# EAGLE design Task2 (EAGLE 9.5.1)
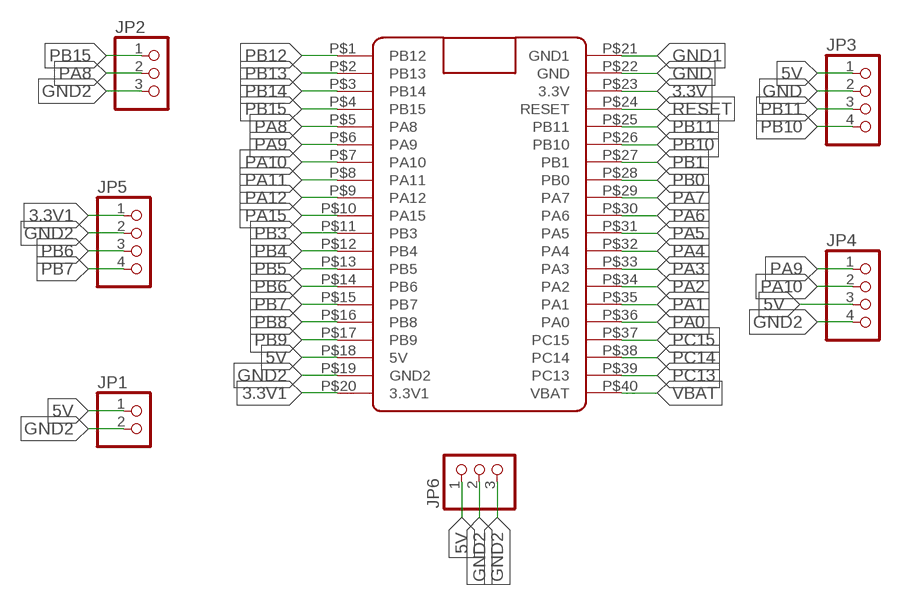
[diagram p0: schematic, sheet 1]

## Parts
JP1  PINHD-1X2  [1X02]
JP2  PINHD-1X3  [1X03]
JP3  PINHD-1X4  [1X04]
JP4  PINHD-1X4  [1X04]
JP5  PINHD-1X4  [1X04]
JP6  PINHD-1X3  [1X03]
U$1  BLUE_PILL  [BLUE_PILL]

## Nets
3.3V: U$1.P$23(3.3V)
3.3V1: JP5.1 U$1.P$20(3.3V1)
5V: JP1.1 JP3.1 JP4.3 JP6.1 U$1.P$18(5V)
GND: JP3.2 U$1.P$22(GND)
GND1: U$1.P$21(GND1)
GND2: JP1.2 JP2.3 JP4.4 JP5.2 JP6.2 JP6.3 U$1.P$19(GND2)
PA0: U$1.P$36(PA0)
PA1: U$1.P$35(PA1)
PA2: U$1.P$34(PA2)
PA3: U$1.P$33(PA3)
PA4: U$1.P$32(PA4)
PA5: U$1.P$31(PA5)
PA6: U$1.P$30(PA6)
PA7: U$1.P$29(PA7)
PA8: JP2.2 U$1.P$5(PA8)
PA9: JP4.1 U$1.P$6(PA9)
PA10: JP4.2 U$1.P$7(PA10)
PA11: U$1.P$8(PA11)
PA12: U$1.P$9(PA12)
PA15: U$1.P$10(PA15)
PB0: U$1.P$28(PB0)
PB1: U$1.P$27(PB1)
PB3: U$1.P$11(PB3)
PB4: U$1.P$12(PB4)
PB5: U$1.P$13(PB5)
PB6: JP5.3 U$1.P$14(PB6)
PB7: JP5.4 U$1.P$15(PB7)
PB8: U$1.P$16(PB8)
PB9: U$1.P$17(PB9)
PB10: JP3.4 U$1.P$26(PB10)
PB11: JP3.3 U$1.P$25(PB11)
PB12: U$1.P$1(PB12)
PB13: U$1.P$2(PB13)
PB14: U$1.P$3(PB14)
PB15: JP2.1 U$1.P$4(PB15)
PC13: U$1.P$39(PC13)
PC14: U$1.P$38(PC14)
PC15: U$1.P$37(PC15)
RESET: U$1.P$24(RESET)
VBAT: U$1.P$40(VBAT)

## Library data of the parts
JP1 = MIA-Training:PINHD-1X2: PIN HEADER
JP2 JP6 = MIA-Training:PINHD-1X3: PIN HEADER
JP3-JP5 = MIA-Training:PINHD-1X4: PIN HEADER
U$1 = BluePill:BLUE_PILL

## Board
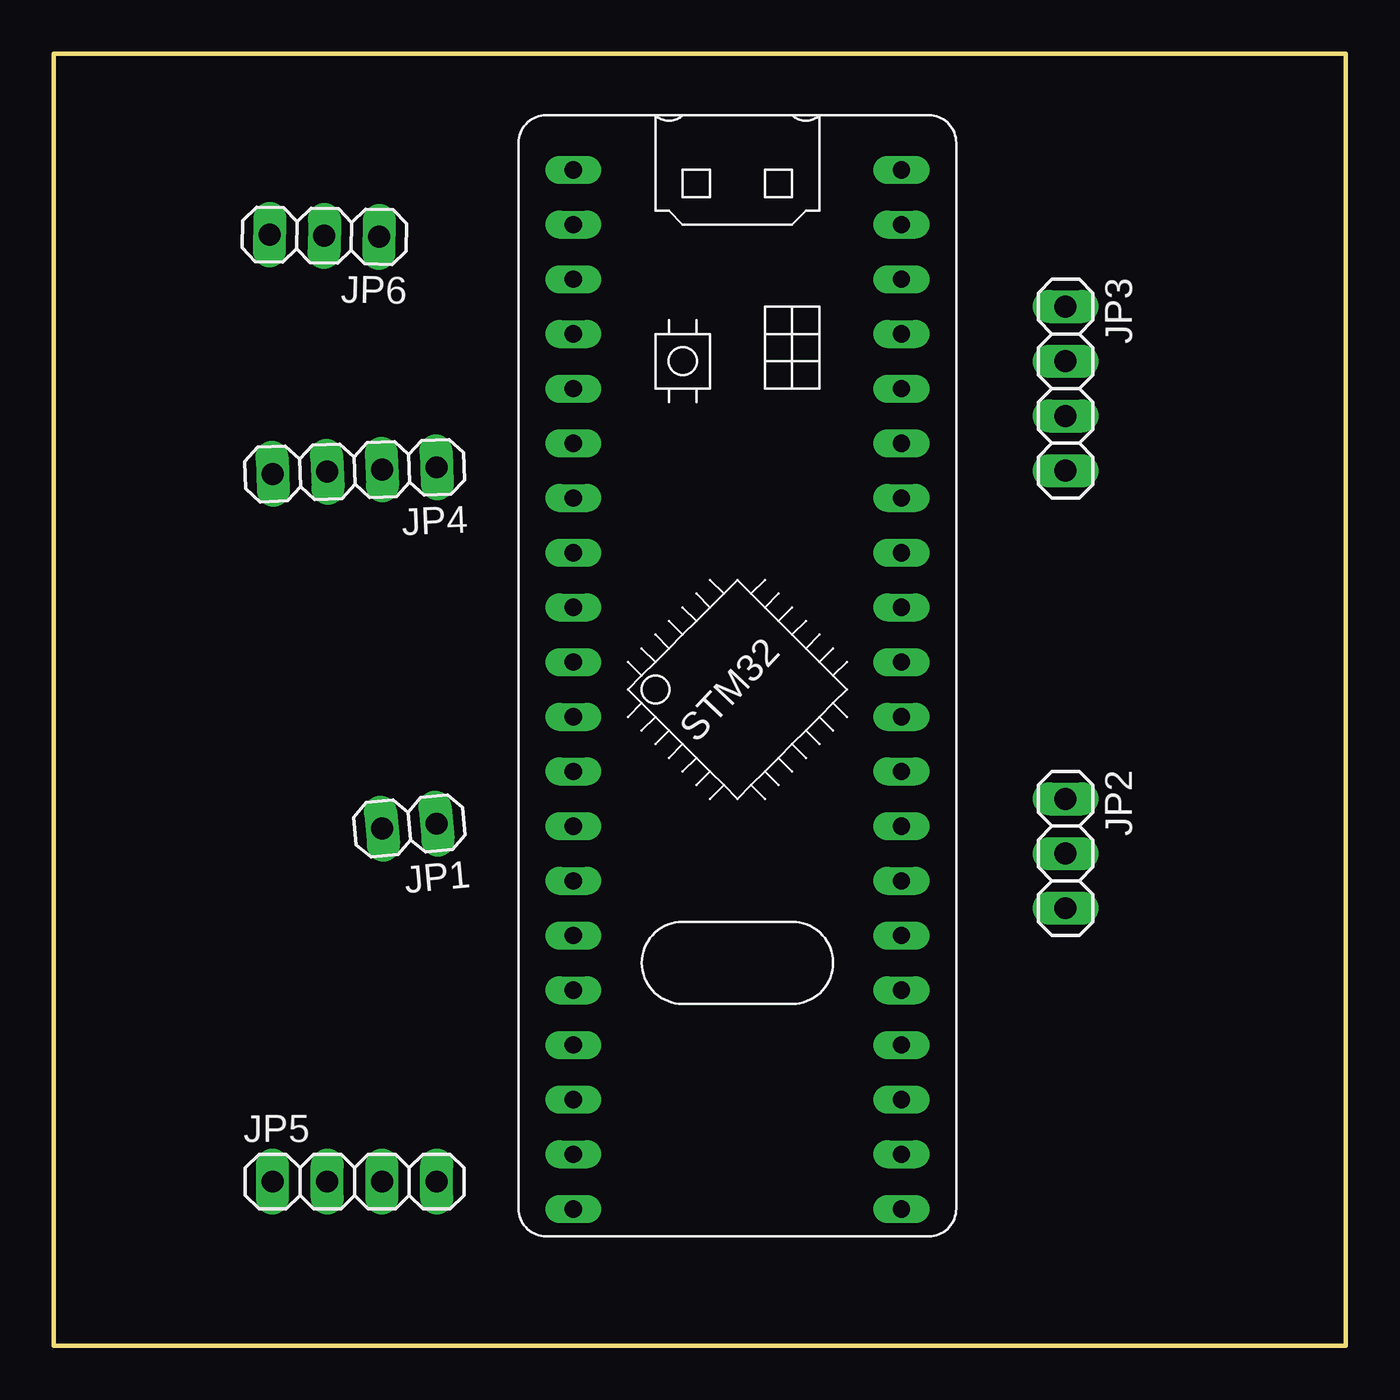
[diagram p1: board, top side]
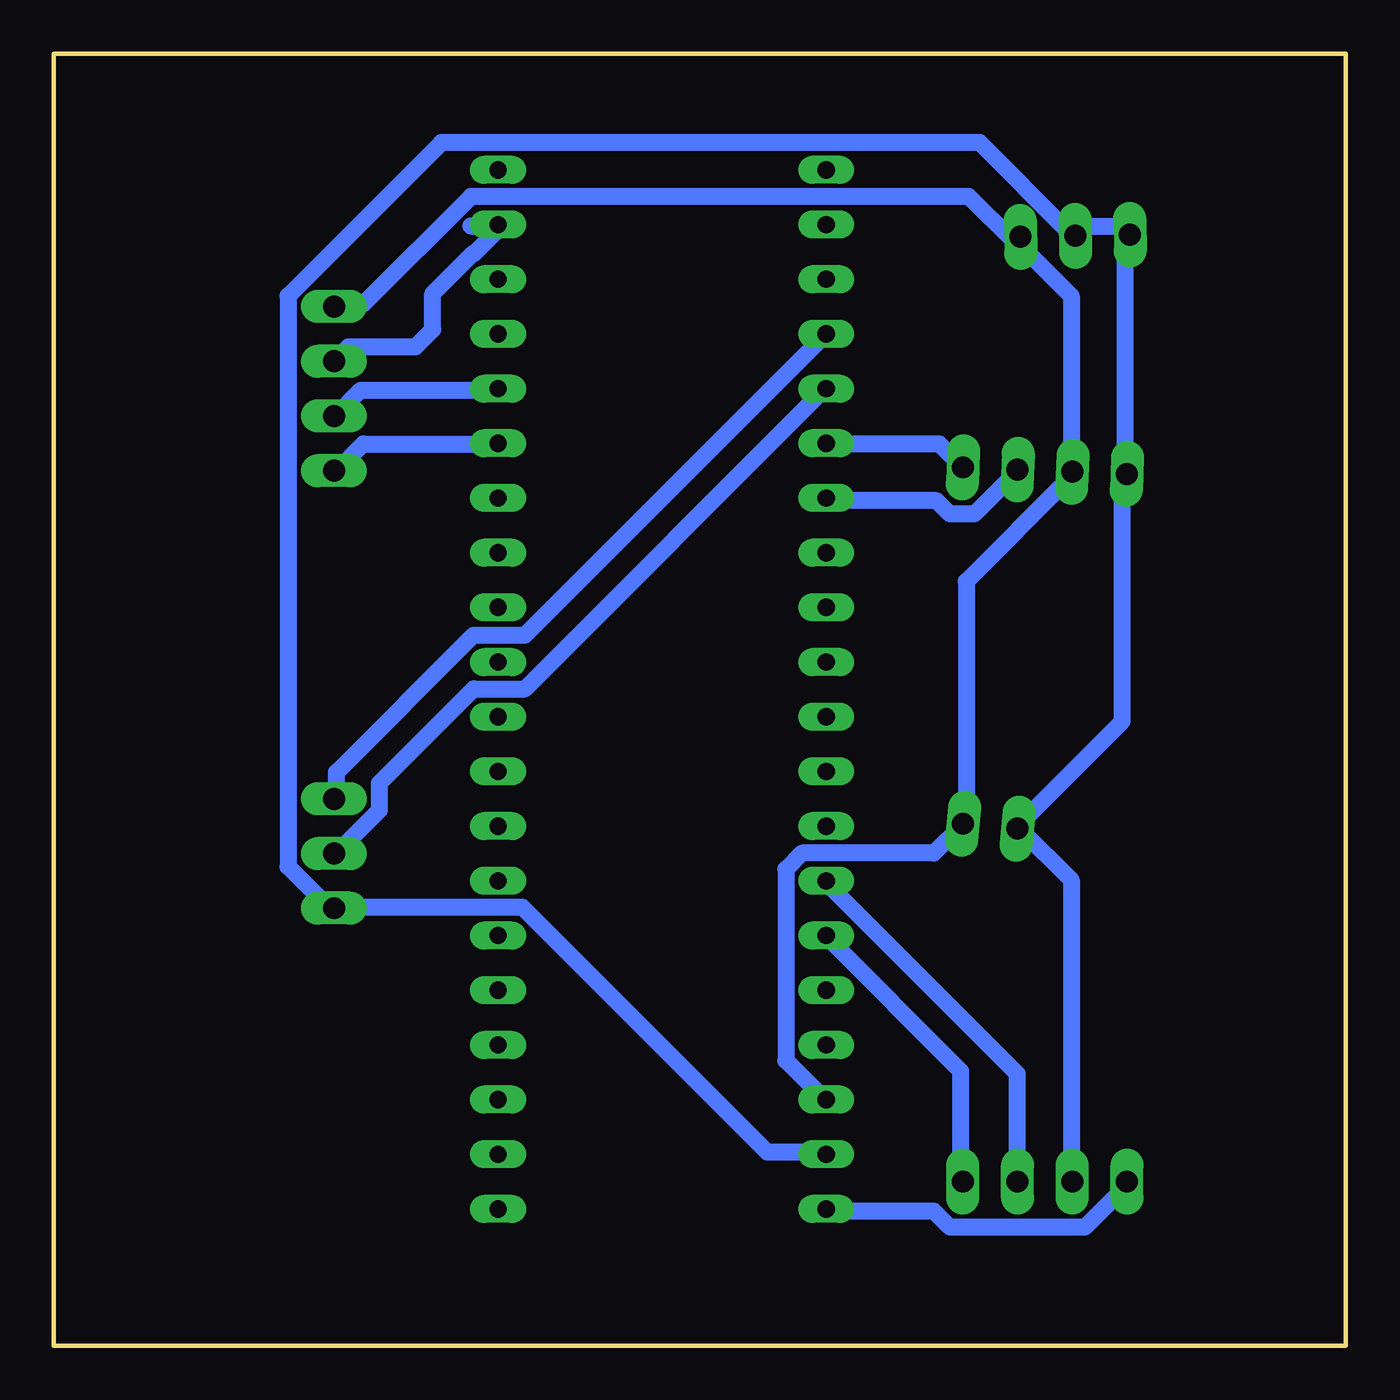
[diagram p2: board, bottom side, seen from below]

Size 60 x 60 mm. Coordinates in mm from the lower left corner, seen from the top.
Outline: 0,0 0,60 60,60 60,0 0,0
Copper layers (1*16): Top 0.035mm / dielectric 1.5mm / Bottom 0.035mm
Design rules "default *": minimum track width 0.8mm, minimum drill 0.35mm, track to track 6mil, track to pad 6mil, pad to pad 6mil, via to via 6mil, smd to smd 6mil, copper to edge 40mil, drill to drill 6mil, minimum pad ring 10mil, minimum via ring 8mil, stop-mask expansion 4mil, vias tented up to drill 0mil, thermal gap 10mil

### Footprints (pad centres in the part's own frame; a part is rotated, then mirrored left to right if it is on the bottom)
1X02 = drill 1.016 long: 1 -1.27,0; 2 1.27,0
1X03 = drill 1.016 long: 1 -2.54,0; 2 0,0; 3 2.54,0
1X04 = drill 1.016 long: 1 -3.81,0; 2 -1.27,0; 3 1.27,0; 4 3.81,0
BLUE_PILL = drill 0.8 long: P$1 -7.62,15.24; P$2 -7.62,12.7; P$3 -7.62,10.16; P$4 -7.62,7.62; P$5 -7.62,5.08; P$6 -7.62,2.54; P$7 -7.62,0; P$8 -7.62,-2.54; P$9 -7.62,-5.08; P$10 -7.62,-7.62; P$11 -7.62,-10.16; P$12 -7.62,-12.7; P$13 -7.62,-15.24; P$14 -7.62,-17.78; P$15 -7.62,-20.32; P$16 -7.62,-22.86; P$17 -7.62,-25.4; P$18 -7.62,-27.94; P$19 -7.62,-30.48; P$20 -7.62,-33.02; P$21 7.62,15.24; P$22 7.62,12.7; P$23 7.62,10.16; P$24 7.62,7.62; P$25 7.62,5.08; P$26 7.62,2.54; P$27 7.62,0; P$28 7.62,-2.54; P$29 7.62,-5.08; P$30 7.62,-7.62; P$31 7.62,-10.16; P$32 7.62,-12.7; P$33 7.62,-15.24; P$34 7.62,-17.78; P$35 7.62,-20.32; P$36 7.62,-22.86; P$37 7.62,-25.4; P$38 7.62,-27.94; P$39 7.62,-30.48; P$40 7.62,-33.02

### Placement (x,y rotation side)
JP1  16.51,24.13 185.2 top
JP2  46.99,22.86 270 top
JP3  46.99,44.45 270 top
JP4  13.97,40.64 182.3 top
JP5  13.97,7.62 0 top
JP6  12.56,51.55 178.9 top
U$1  31.75,39.37 0 top

### Tracks (layer width: path | path; a pad name or v marks a point on that pad's centre or on a via)
3.3V1
  Bottom 0.8: U$1.P$20 24.12,6.25 19.12,6.25 18.38,5.5 12.12,5.5 10.12,7.5 JP5.1
5V
  Bottom 0.8: U$1.P$18 24.25,11.5 26,13.25 26,22.12 25.25,22.88 19.12,22.88 17.88,24.12 JP1.1 17.62,24.62 17.62,35.5 12.88,40.25 JP4.3 12.75,40.62 12.75,48.75 15,51 JP6.1 15.38,51.25 17.5,53.38 40.62,53.38 45.62,48.38 46.88,48.38 JP3.1
GND
  Bottom 0.8: 40.62,52 39.38,52 | 39.38,52 U$1.P$22 | 46.88,45.75 JP3.2 46.31,46.4 43.2,46.4 42.4,47.2 42.4,48.86 40.52,50.74 40.46,50.74 39.38,51.83 39.38,52
GND2
  Bottom 0.8: U$1.P$19 24.25,9 26.88,9 38.25,20.38 46.88,20.38 JP2.3 47.25,20.62 47.5,20.62 49.12,22.25 49.12,48.75 42,55.88 17,55.88 12.88,51.75 JP6.2 12.5,51.62 12.12,52 10.12,52 JP6.3 10.25,51.62 10.25,40.5 JP4.4 10.38,40.12 10.38,29 15,24.38 JP1.2 15.12,24 12.75,21.62 12.75,7.62 JP5.2
PA8
  Bottom 0.8: U$1.P$5 24.25,44.38 38.12,30.5 40.5,30.5 44.88,26.12 44.88,24.88 46.88,22.88 JP2.2
PA9
  Bottom 0.8: U$1.P$6 24.12,41.88 18.88,41.88 17.88,40.88 JP4.1
PA10
  Bottom 0.8: U$1.P$7 24.12,39.25 19,39.25 18.38,38.62 17.25,38.62 15.25,40.62 JP4.2
PB6
  Bottom 0.8: U$1.P$14 24.12,21.5 15.25,12.62 JP5.3
PB7
  Bottom 0.8: U$1.P$15 24.12,19 17.88,12.75 17.88,7.62 JP5.4
PB10
  Bottom 0.8: U$1.P$26 39.38,41.88 45.62,41.88 46.88,40.62 JP3.4
PB11
  Bottom 0.8: U$1.P$25 39.38,44.38 45.75,44.38 46.88,43.25 JP3.3
PB15
  Bottom 0.8: U$1.P$4 24.25,46.88 38.12,33 40.5,33 46.88,26.62 46.88,25.5 JP2.1